# EasyEDA Pro project TC358870 HDMI2MIPI.epro, schematic new_1

## Sheets
1 Bridge
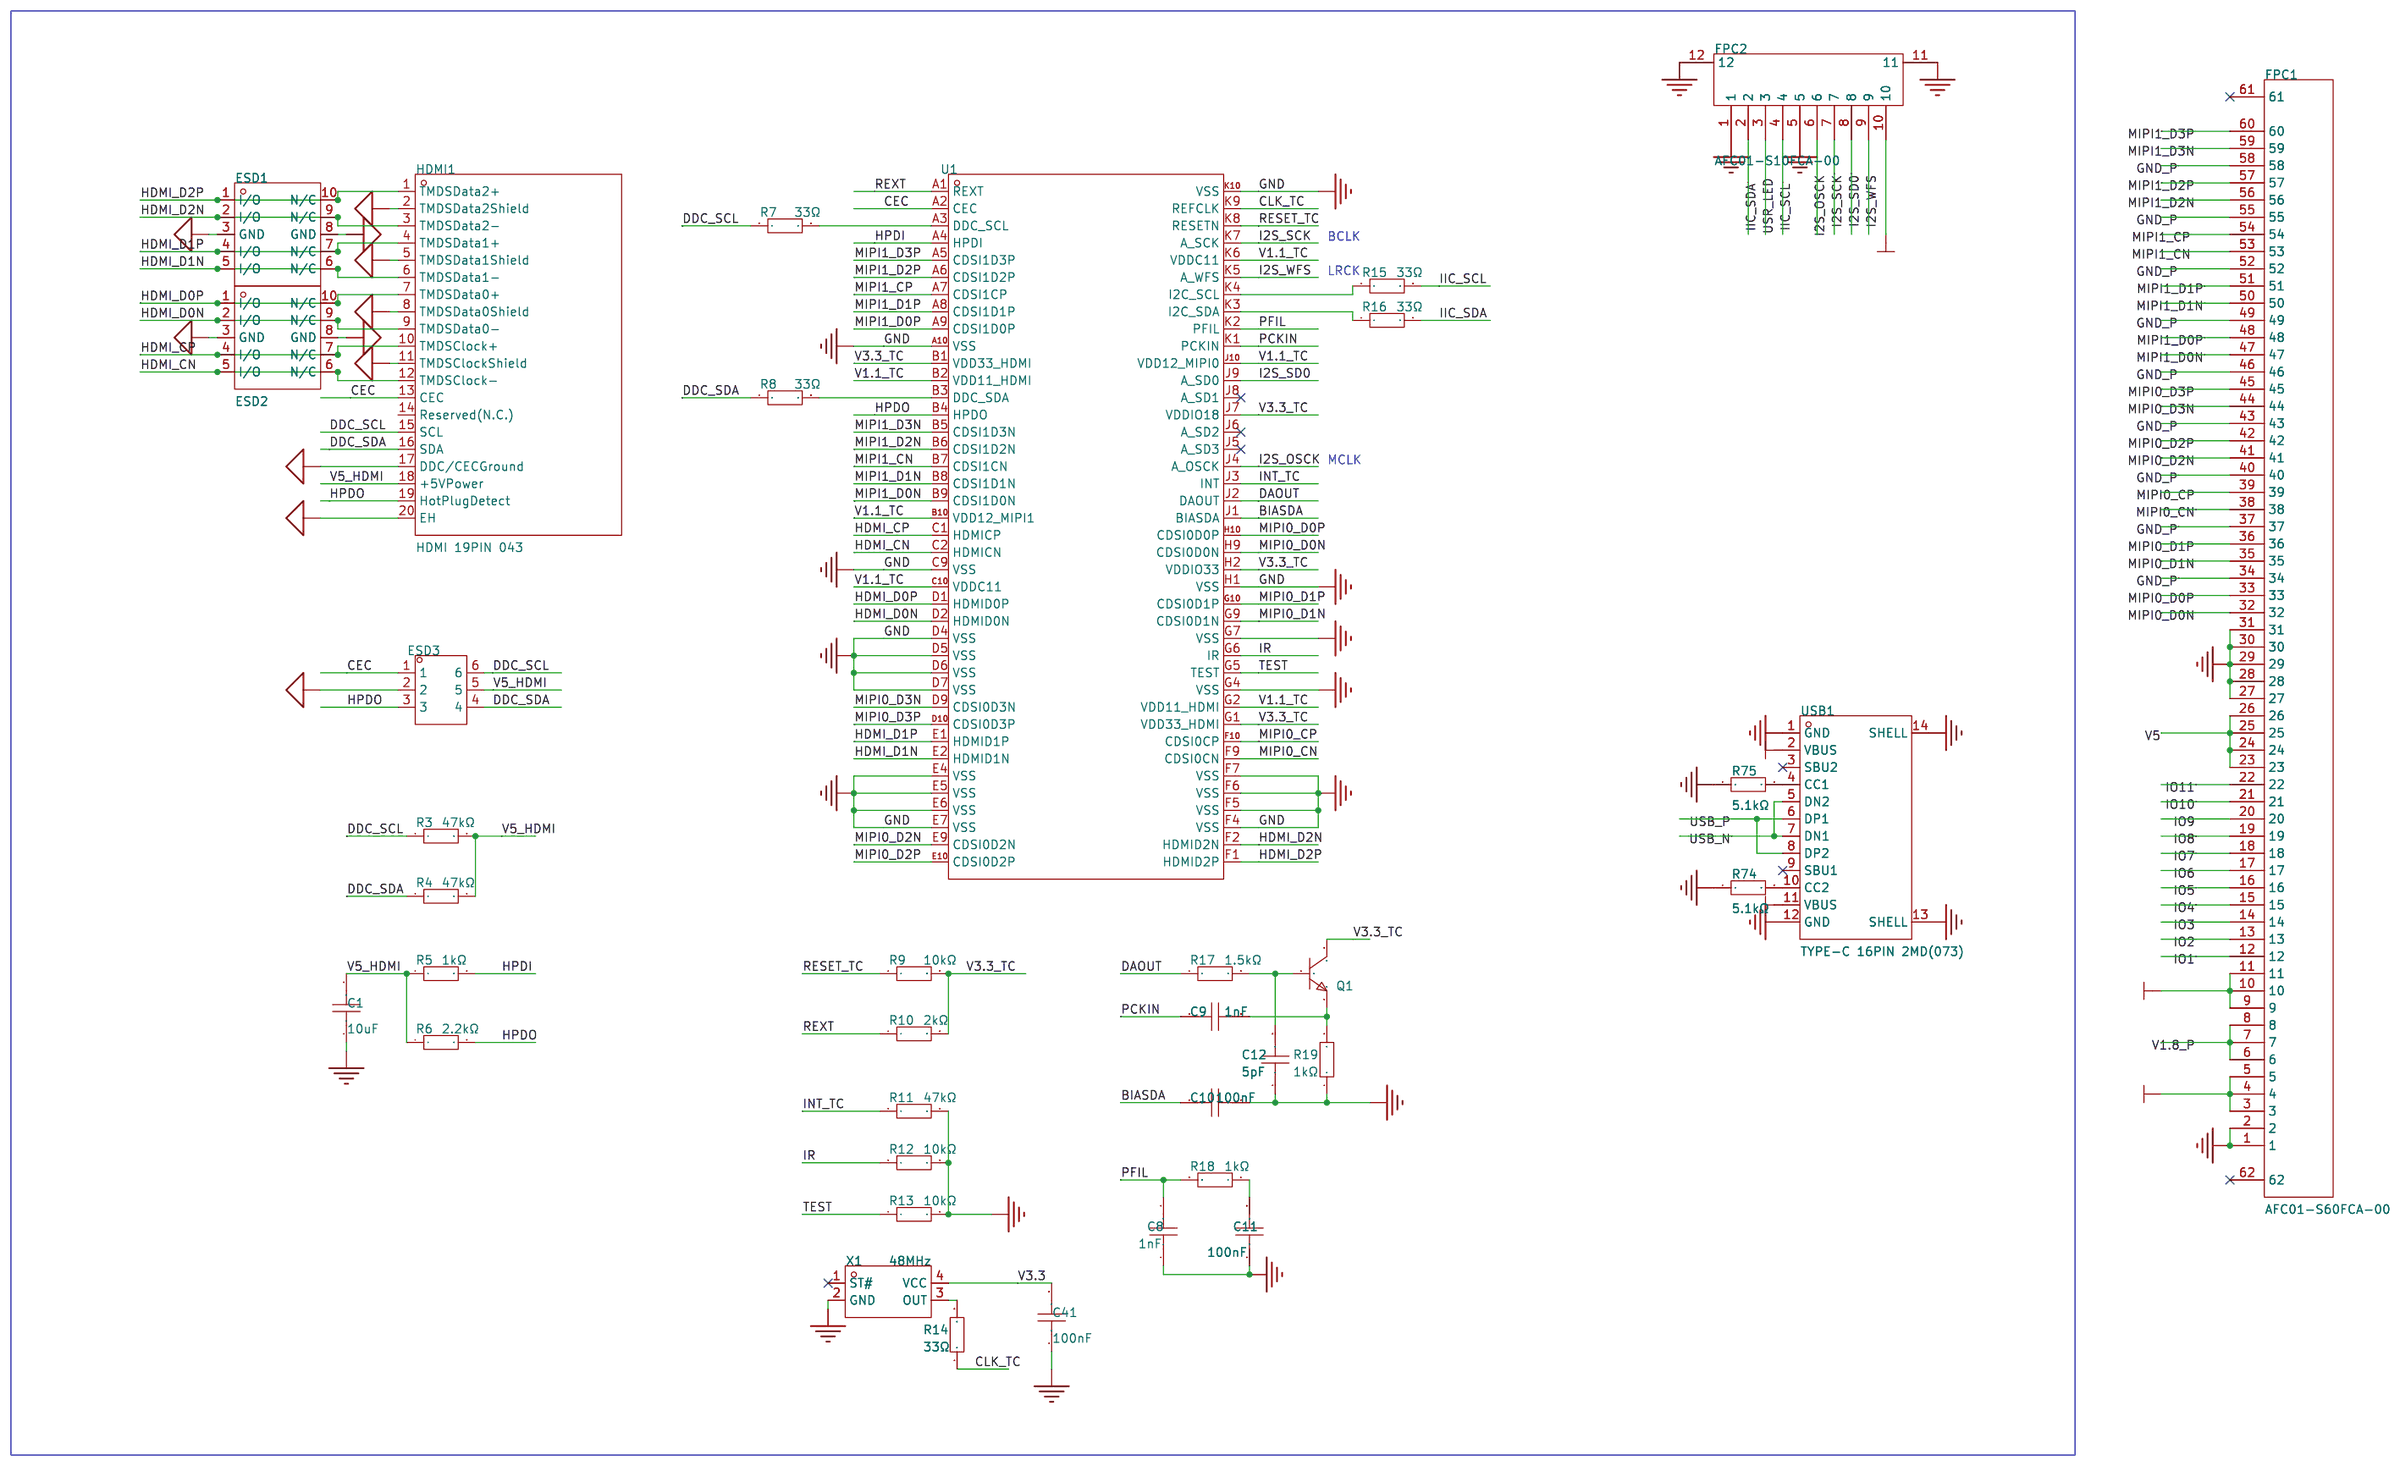
[diagram p2: Bridge]
2 MCU
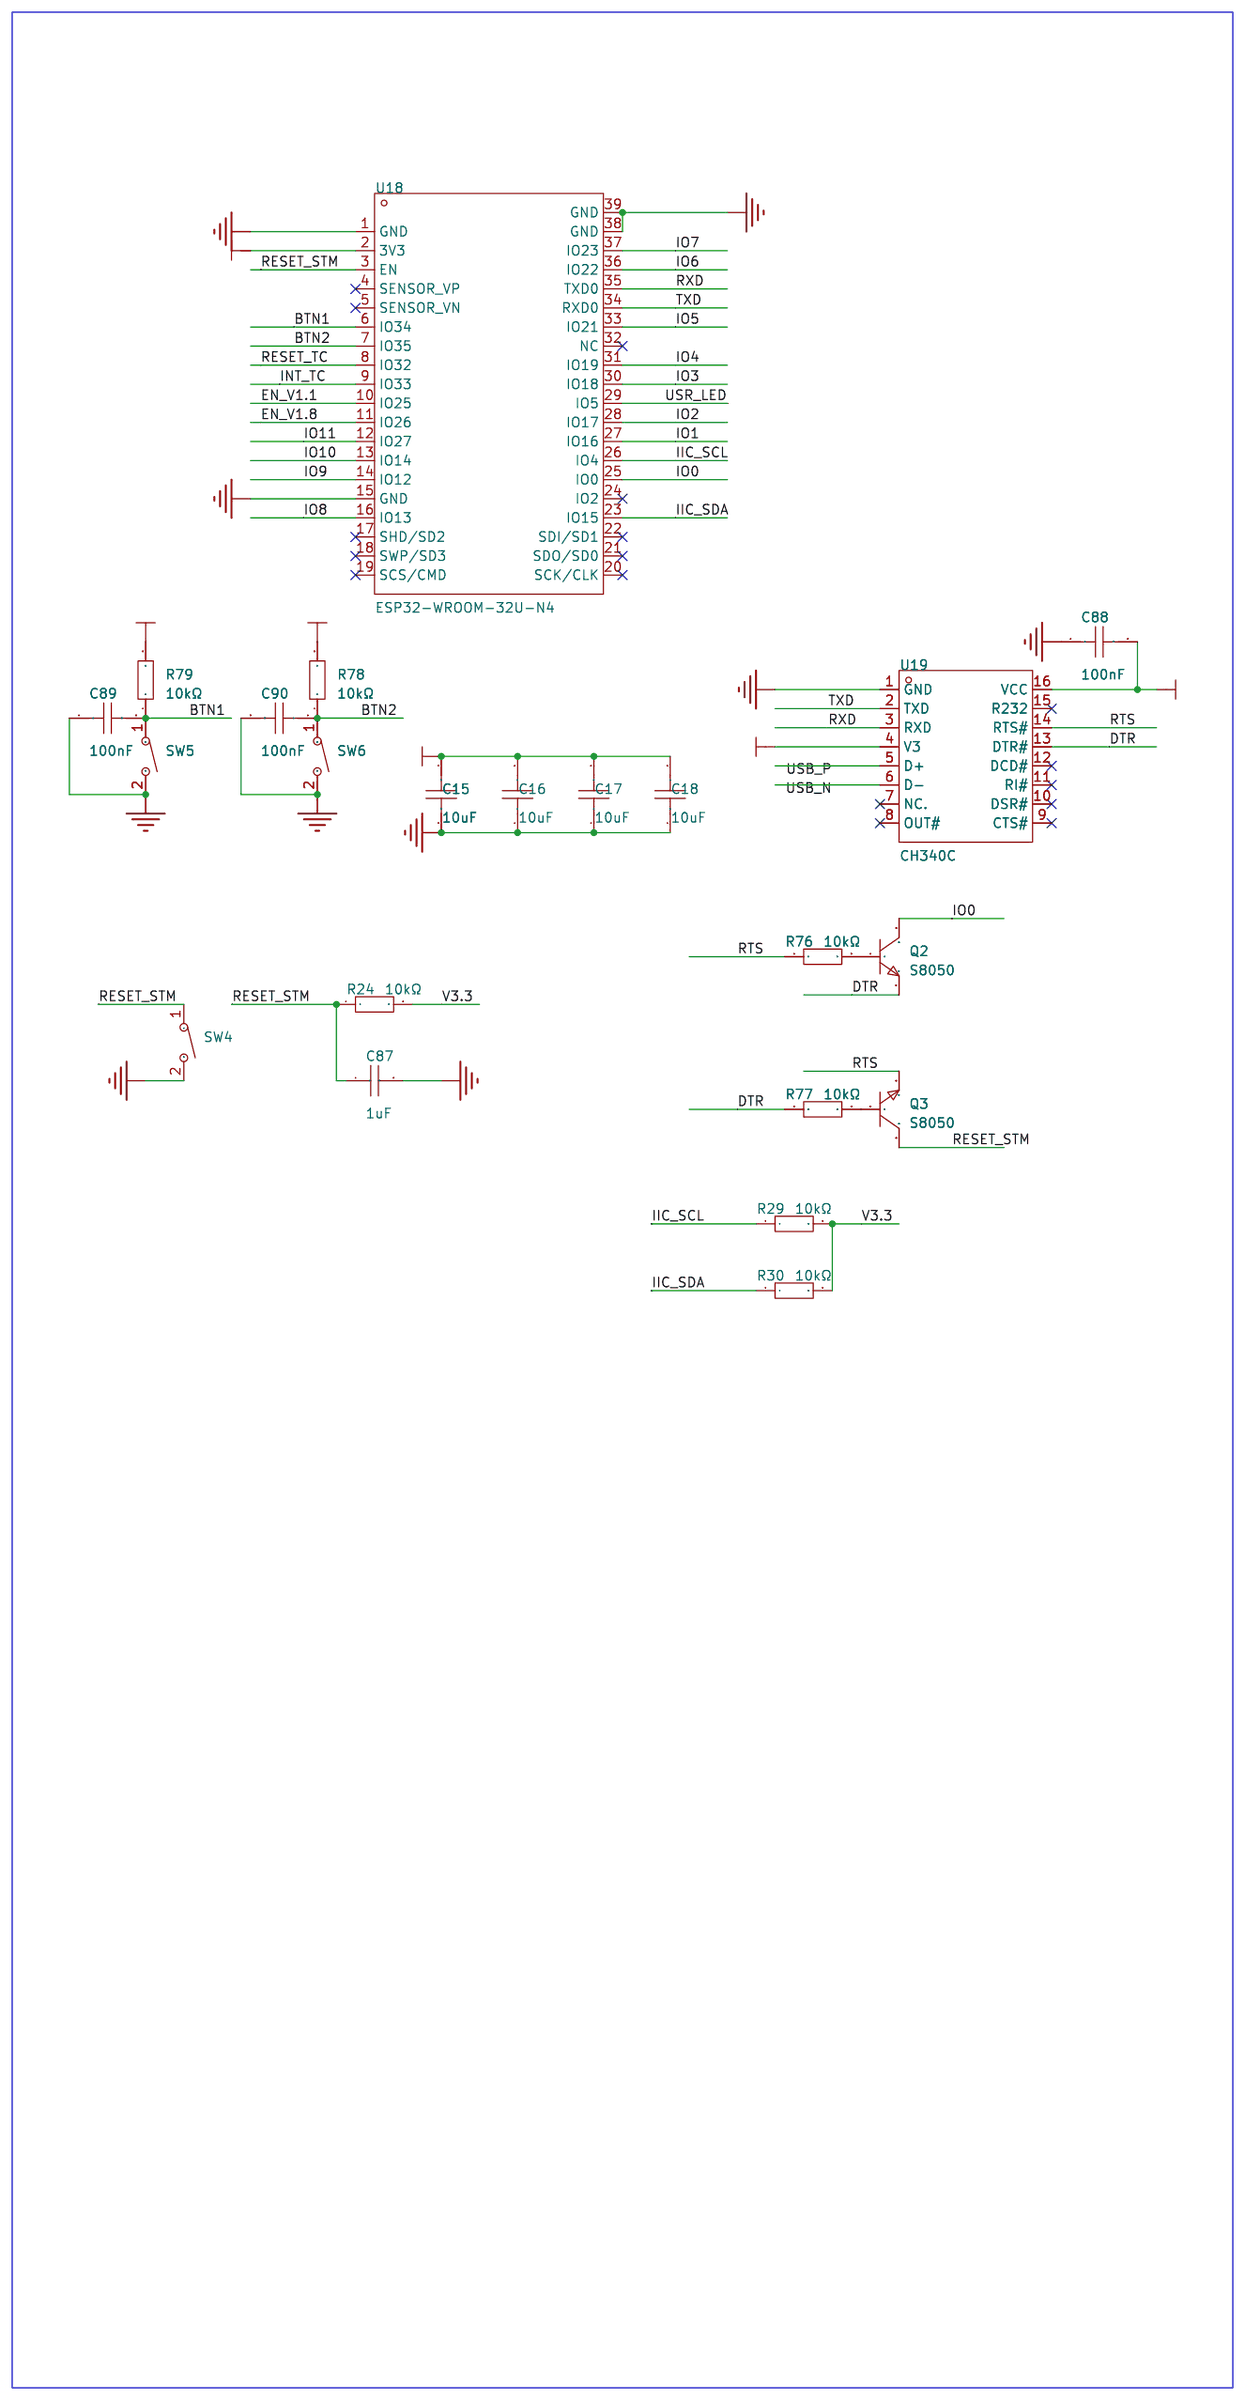
[diagram p3: MCU]
3 Power
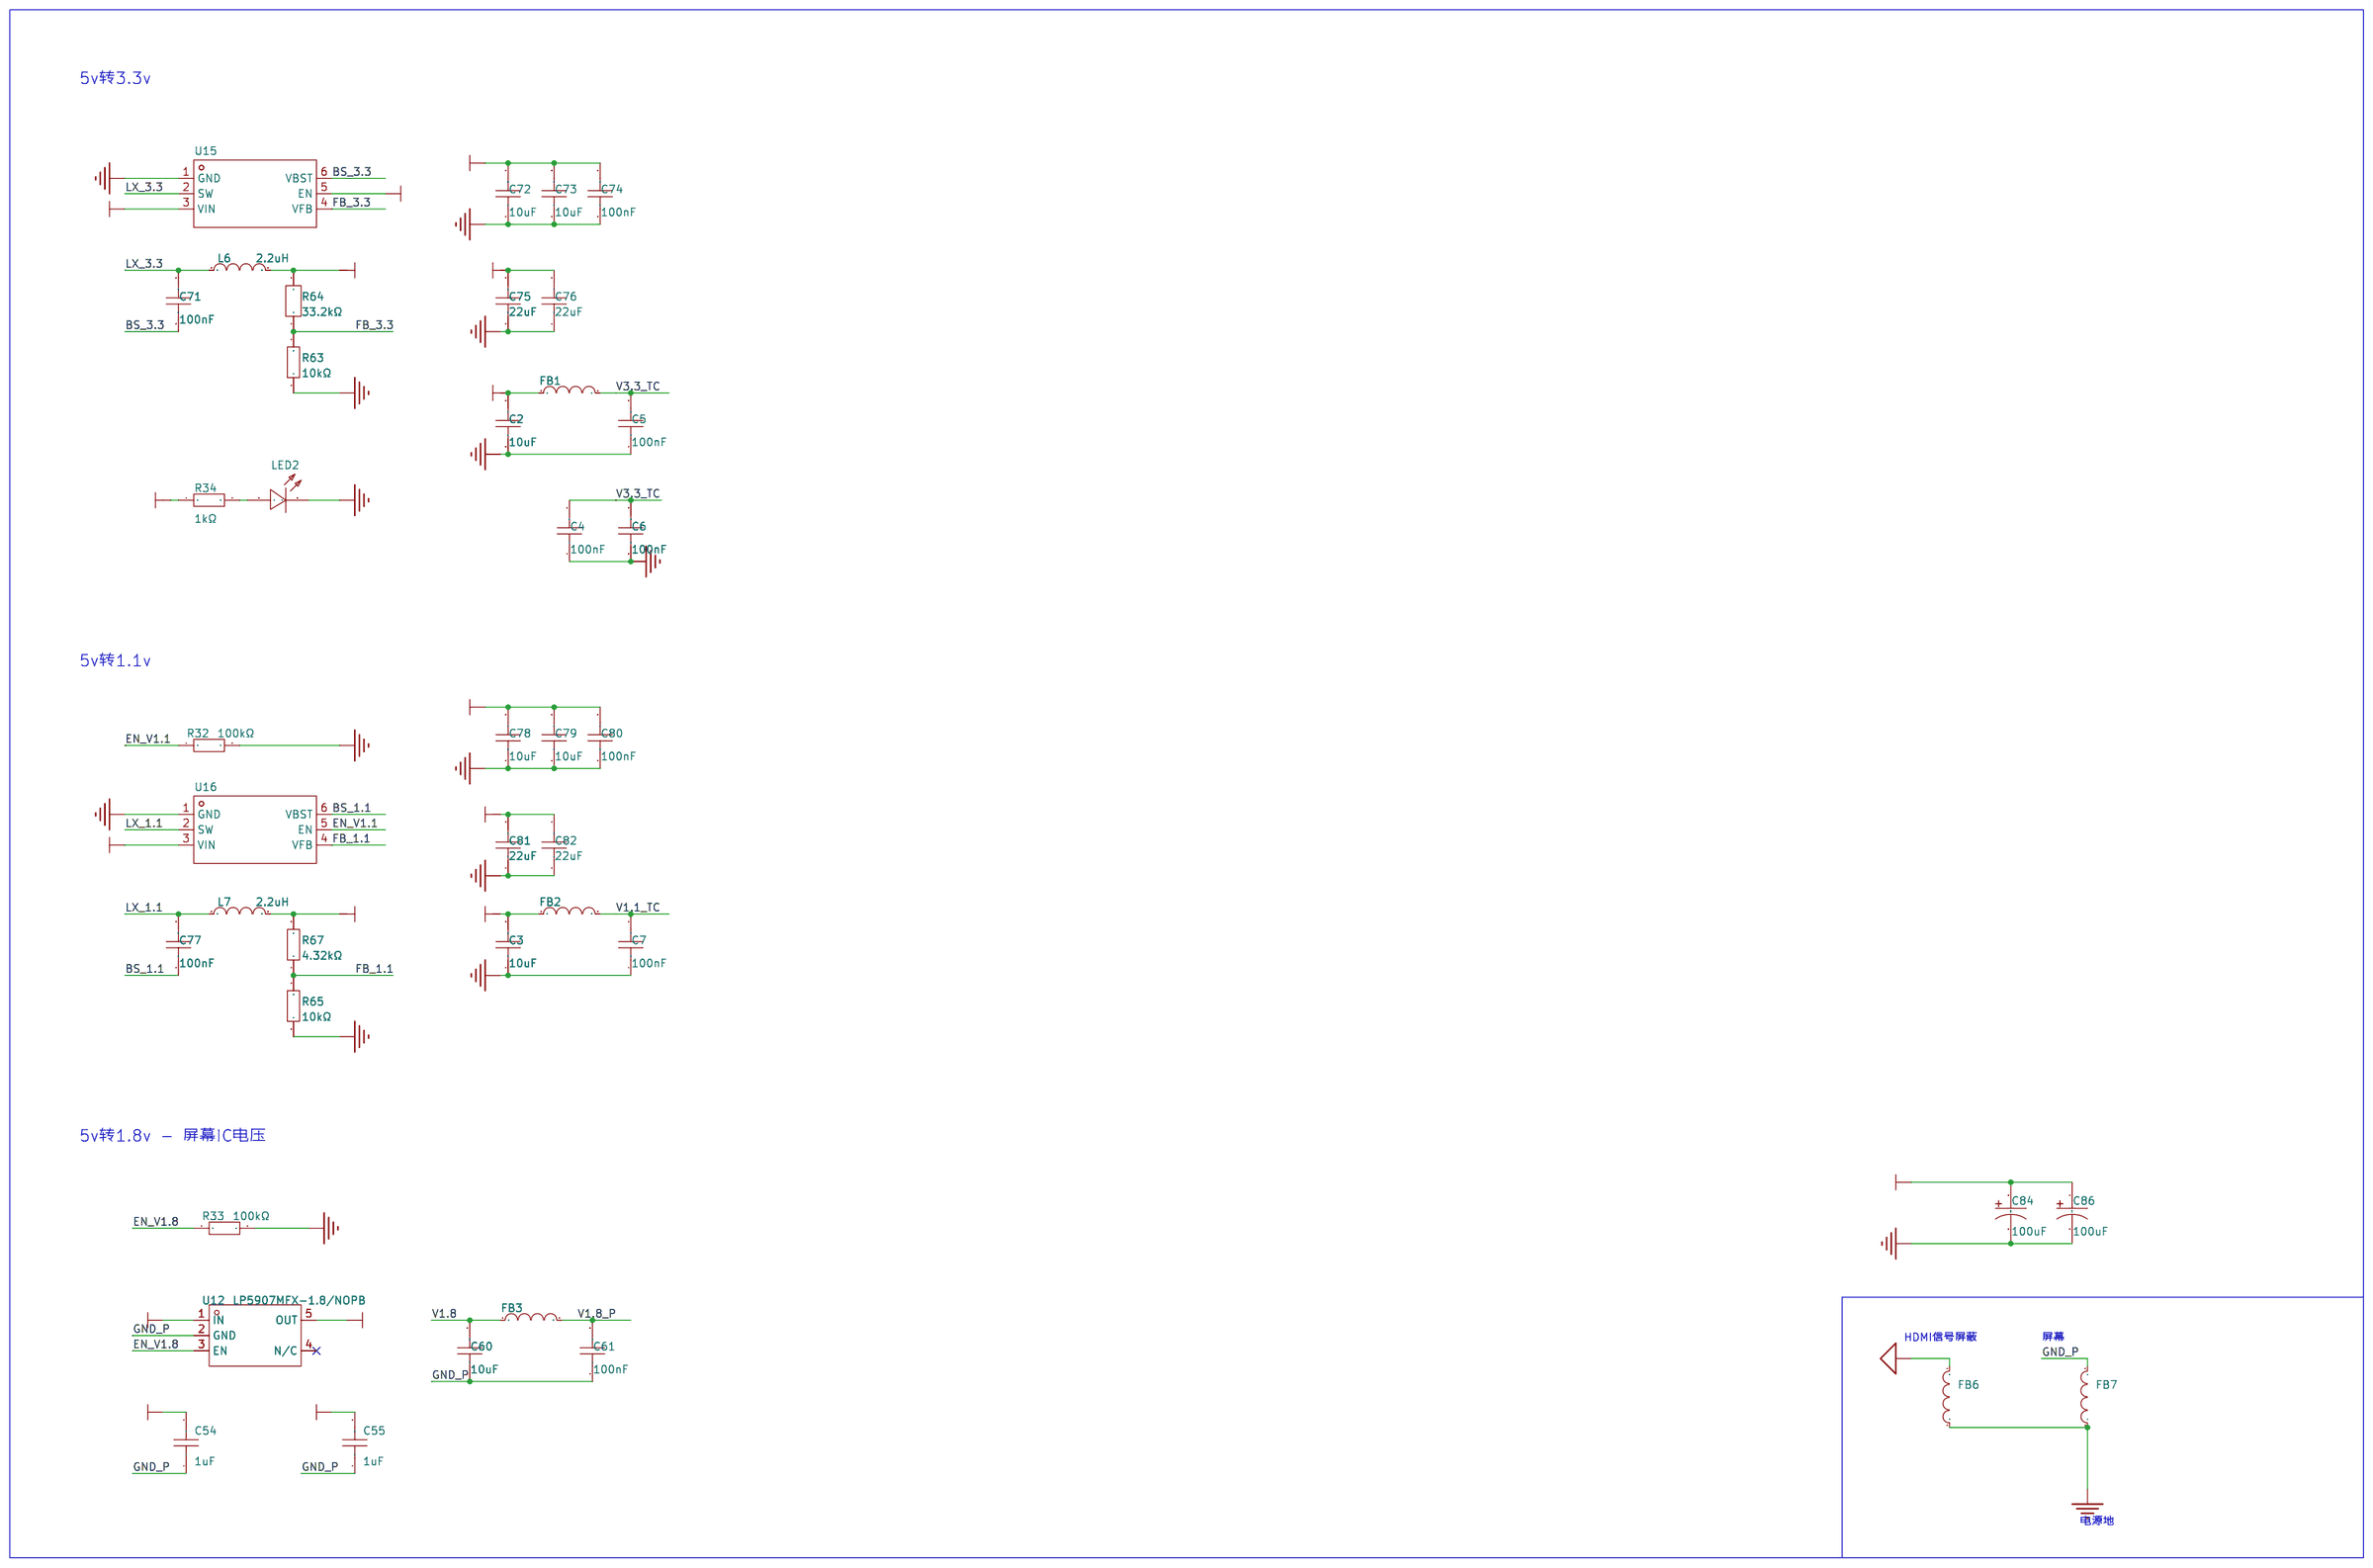
[diagram p4: Power]

## Parts
sheet Bridge
C1  10uF  [C0603]
C8  1nF  [C0603]
C9  1nF  [C0603]
C10  100nF  [C0603]
C11  100nF  [C0603]
C12  5pF  [C0603]
C41  100nF  [C0603]
ESD1  ESD7004MUTAG  [UDFN-10_L2.5-W1.0-P0.50-BL]
ESD2  ESD7004MUTAG  [UDFN-10_L2.5-W1.0-P0.50-BL]
ESD3  NUP4114HMR6T1G  [SOT-23-6_L2.9-W1.6-P0.95-LS2.8-BR]
FPC1  AFC01-S60FCA-00  [FPC-SMD_AFC01-S60FCC-00]
FPC2  AFC01-S10FCA-00  [FPC-SMD_P0.5-10P_FGS-XJ-H2.0]
HDMI1  HDMI 19PIN 043  [HDMI-SMD_HDMI-19PIN-043]
Q1  S8050  [SOT-23-3_L2.9-W1.6-P1.90-LS2.8-BR]
R3  47kΩ  [R0603]
R4  47kΩ  [R0603]
R5  1kΩ  [R0603]
R6  2.2kΩ  [R0603]
R7  33Ω  [R0603]
R8  33Ω  [R0603]
R9  10kΩ  [R0603]
R10  2kΩ  [R0603]
R11  47kΩ  [R0603]
R12  10kΩ  [R0603]
R13  10kΩ  [R0603]
R14  33Ω  [R0603]
R15  33Ω  [R0603]
R16  33Ω  [R0603]
R17  1.5kΩ  [R0603]
R18  1kΩ  [R0603]
R19  1kΩ  [R0603]
R74  5.1kΩ  [R0603]
R75  5.1kΩ  [R0603]
U1  TC358870XBG(NOK)  [P-VFBGA-80_L7.0-W7.0-R10-C10-P0.65-TL]
USB1  TYPE-C 16PIN 2MD(073)  [USB-C-SMD_TYPE-C-6PIN-2MD-073]
X1  48MHz  [OSC-SMD_4P-L3.2-W2.5-BL]
sheet MCU
C15  10uF  [C0603]
C16  10uF  [C0603]
C17  10uF  [C0603]
C18  10uF  [C0603]
C87  1uF  [C0603]
C88  100nF  [C0603]
C89  100nF  [C0603]
C90  100nF  [C0603]
Q2  S8050  [SOT-23-3_L2.9-W1.6-P1.90-LS2.8-BR]
Q3  S8050  [SOT-23-3_L2.9-W1.6-P1.90-LS2.8-BR]
R24  10kΩ  [R0603]
R29  10kΩ  [R0603]
R30  10kΩ  [R0603]
R76  10kΩ  [R0603]
R77  10kΩ  [R0603]
R78  10kΩ  [R0603]
R79  10kΩ  [R0603]
SW4  -  [SW-SMD_L4.0-W2.9-LS5.0]
SW5  -  [SW-SMD_L4.0-W2.9-LS5.0]
SW6  -  [SW-SMD_L4.0-W2.9-LS5.0]
U18  ESP32-WROOM-32U-N4  [WIFIM-SMD_38P-L19.2-W18.0-P1.27]
U19  CH340C  [SOP-16_L10.0-W3.9-P1.27-LS6.0-BL]
sheet Power
C2  10uF  [C0603]
C3  10uF  [C0603]
C4  100nF  [C0603]
C5  100nF  [C0603]
C6  100nF  [C0603]
C7  100nF  [C0603]
C54  1uF  [C0603]
C55  1uF  [C0603]
C60  10uF  [C0603]
C61  100nF  [C0603]
C71  100nF  [C0603]
C72  10uF  [C0603]
C73  10uF  [C0603]
C74  100nF  [C0603]
C75  22uF  [C0603]
C76  22uF  [C0603]
C77  100nF  [C0603]
C78  10uF  [C0603]
C79  10uF  [C0603]
C80  100nF  [C0603]
C81  22uF  [C0603]
C82  22uF  [C0603]
C84  100uF  [CAP-SMD_L3.5-W2.8-R-RD]
C86  100uF  [CAP-SMD_L3.5-W2.8-R-RD]
FB1  BLM18PG121SN1D  [L0603]
FB2  BLM18PG121SN1D  [L0603]
FB3  BLM18PG121SN1D  [L0603]
FB6  BLM18PG121SN1D  [L0603]
FB7  BLM18PG121SN1D  [L0603]
L6  2.2uH  [IND-SMD_L2.5-W2.0]
L7  2.2uH  [IND-SMD_L2.5-W2.0]
LED2  -  [LED0603-R-RD_WHITE]
R32  100kΩ  [R0603]
R33  100kΩ  [R0603]
R34  1kΩ  [R0603]
R63  10kΩ  [R0603]
R64  33.2kΩ  [R0603]
R65  10kΩ  [R0603]
R67  4.32kΩ  [R0603]
U12  LP5907MFX-1.8/NOPB  [SOT-23-5_L3.0-W1.7-P0.95-LS2.8-BR]
U15  TPS562208DDCR  [SOT-23-6_L2.9-W1.6-P0.95-LS2.8-BR]
U16  TPS562208DDCR  [SOT-23-6_L2.9-W1.6-P0.95-LS2.8-BR]

## Library data of the parts
C1-C3 C15-C18 C60 C72 C73 C78 C79 = CC0603MRX5R8BB106: 容值:10uF;精度:±20%;额定电压:25V;材质(温度系数):X5R;; LCSC Part Name: 10uF ±20% 25V; Supplier Part: C596327; Manufacturer: YAGEO(国巨); Supplier Footprint: 0603; JLCPCB Part Class: 扩展库; Datasheet: https://atta.szlcsc.com/upload/public/pdf/source/20200609/C596327_17DF31B1E9B32F0BAA34398C136F635E.pdf; Supplier: LCSC; Tolerance: ±20%; Voltage Rated: 25V; Temperature Coefficient: X5R
C8 C9 = CL10B102KB8NNNC: 容值:1nF;精度:±10%;额定电压:50V;材质(温度系数):X7R;; LCSC Part Name: 1nF ±10% 50V; Supplier Part: C1588; Manufacturer: SAMSUNG(三星); Supplier Footprint: 0603; JLCPCB Part Class: Basic Part; Datasheet: https://atta.szlcsc.com/upload/public/pdf/source/20160103/1457707679526.pdf; Supplier: LCSC; Tolerance: ±10%; Voltage Rated: 50V; Temperature Coefficient: X7R
C4-C7 C10 C11 C41 C61 C71 C74 C77 C80 C88-C90 = CC0603KRX7R9BB104: 容值:100nF;精度:±10%;额定电压:50V;材质(温度系数):X7R;; LCSC Part Name: 100nF ±10% 50V; Supplier Part: C14663; Manufacturer: YAGEO(国巨); Supplier Footprint: 0603; JLCPCB Part Class: 基础库; Datasheet: https://atta.szlcsc.com/upload/public/pdf/source/20170116/1484561234239.pdf; Supplier: LCSC; Tolerance: ±10%; Voltage Rated: 50V; Temperature Coefficient: X7R
C12 = CL10C050BB8NNNC: 容值:5pF;精度:±0.1pF;额定电压:50V;材质(温度系数):C0G;; LCSC Part Name: 5pF ±0.1pF 50V; Supplier Part: C307495; Manufacturer: SAMSUNG(三星); Supplier Footprint: 0603; JLCPCB Part Class: Extended Part; Datasheet: https://atta.szlcsc.com/upload/public/pdf/source/20181106/C307495_40E91552D1B784076ED9D3C3B46C5793.pdf; Supplier: LCSC; Tolerance: ±0.1pF; Voltage Rated: 50V; Temperature Coefficient: C0G
ESD1 ESD2 = ESD7004MUTAG: 反向截止电压(Vrwm):5V;击穿电压(VBR):5.5V;峰值脉冲电流(Ipp)@8/20us:1A@(8/20us);钳位电压(Vc)@Ipp:10V;峰值脉冲功率(Ppp)@8/20us:-;结电容(Cj)@1MHz:0.4pF@1MHz;工作温度:-55℃~+125℃@(Tj);; LCSC Part Name: ESD Protection Diode with Low Capacitance; Supplier Part: C1972960; Manufacturer: onsemi(安森美); Supplier Footprint: UDFN-10(1x2.5); JLCPCB Part Class: 扩展库; Datasheet: https://atta.szlcsc.com/upload/public/pdf/source/20201127/C294530_C0006EA10DA7174AECD43404D82BADC3.pdf; Supplier: LCSC; Reverse Stand-Off Voltage (Vrwm): 5V; Breakdown Voltage (VBR): 5.5V; Peak Pulse Current(Ipp)@8/20us: 1A@(8/20us); Clamping Voltage@Ipp: 10V; Junction Capacitance(Cj)@1MHz: 0.4pF@1MHz; Operating Temperature: -55℃~+125℃@(Tj)
ESD3 = NUP4114HMR6T1G: Supplier Part: C260431; Manufacturer: onsemi(安森美); Supplier Footprint: SOT-23-6; JLCPCB Part Class: 扩展库; Datasheet: https://atta.szlcsc.com/upload/public/pdf/source/20180801/C260431_50B6EE707D505754417F87B3D09AAF49.pdf; Supplier: LCSC
FPC1 = AFC01-S60FCA-00: 锁定特性:翻盖式;触点类型:下接;触点数量:60P;间距:0.5mm;安装类型:卧贴;; LCSC Part Name: 间距:0.5mm P数:60P 翻盖式 下接; Supplier Part: C262678; Manufacturer: JS(钜硕电子); Supplier Footprint: SMD,P=0.5mm,卧贴; JLCPCB Part Class: 扩展库; Datasheet: https://atta.szlcsc.com/upload/public/pdf/source/20190726/C11047_78689421E6D6672DE8D11ECCF89B3729.pdf; Supplier: LCSC; Locking Feature: 翻盖式; Contact Type: 下接; Number of Contacts: 60P; Pitch: 0.5mm; Mounting Type: 卧贴; FFC, FCB Thickness: 0.3mm; Height Above Board: 2mm
FPC2 = AFC01-S10FCA-00: 锁定特性:翻盖式;触点类型:下接;触点数量:10P;间距:0.5mm;安装类型:卧贴;; LCSC Part Name: 间距:0.5mm P数:10P 翻盖式 下接; Supplier Part: C262659; Manufacturer: JS(钜硕电子); Supplier Footprint: SMD,P=0.5mm,卧贴; JLCPCB Part Class: 扩展库; Datasheet: https://atta.szlcsc.com/upload/public/pdf/source/20190816/C413942_2A72D1AC756EAE17EEDF756A339D4500.pdf; Supplier: LCSC; Locking Feature: 翻盖式; Contact Type: 下接; Number of Contacts: 10P; Pitch: 0.5mm; Mounting Type: 卧贴; FFC, FCB Thickness: 0.3mm; Height Above Board: 2mm
HDMI1 = HDMI 19PIN 043: 连接器类型:HDMI;公母:母;总PIN位数:19P;安装方式:卧贴;排数:-;额定电流:300mA;工作温度范围:-55℃~+85℃;; LCSC Part Name: HDMI 母 P数:19P; Supplier Part: C2858275; Manufacturer: SHOU HAN(首韩); Supplier Footprint: SMD; JLCPCB Part Class: 扩展库; Datasheet: https://atta.szlcsc.com/upload/public/pdf/source/20210728/C2858275_DF299413048A9CF092C2A61AB97004F4.pdf; Supplier: LCSC; Connector Type: HDMI; Gender: 母; Number of Pins: 19P; Mounting Style: 卧贴; Current Rating (Max): 300mA; Operating Temperature Range: -55℃~+85℃
Q1-Q3 = S8050_C181158: 晶体管类型:NPN;集电极电流(Ic):500mA;集射极击穿电压(Vceo):25V;功率(Pd):300mW;; LCSC Part Name: NPN 电流:500mA 耐压:25V; Supplier Part: C181158; Manufacturer: Hottech(合科泰); Supplier Footprint: SOT-23; JLCPCB Part Class: Extended Part; Datasheet: https://atta.szlcsc.com/upload/public/pdf/source/20220506/D987F39D56F2975D34EC7947E75C4ABC.pdf; Supplier: LCSC; Transistor Type: NPN; Collector Current (Ic): 500mA; Collector-Emitter Breakdown Voltage (Vceo): 25V; Power Dissipation (Pd): 300mW; Transition Frequency (fT): 150MHz; Collector Cut-Off Current (Icbo): 100nA; Collector-Emitter Saturation Voltage (VCE(sat)@Ic,Ib): 600mV@500mA,50mA
R3 R4 = CR0603FA4702G: 电阻类型:厚膜电阻;阻值:47kΩ;精度:±1%;功率:100mW;温度系数:±100ppm/℃;最大工作电压:50V;工作温度范围:-55℃~+125℃;; LCSC Part Name: 47kΩ ±1% 100mW; Supplier Part: C101063; Manufacturer: LIZ(丽智电子); Supplier Footprint: 0603; JLCPCB Part Class: 扩展库; Datasheet: https://atta.szlcsc.com/upload/public/pdf/source/20170408/1491631381276.pdf; Supplier: LCSC; Type: 厚膜电阻; Tolerance: ±1%; Power(Watts): 100mW; Temperature Coefficient: ±100ppm/℃; Overload Voltage (Max): 50V; Operating Temperature Range: -55℃~+125℃
R5 R34 = 0603WAF1001T5E: 电阻类型:厚膜电阻;阻值:1kΩ;精度:±1%;功率:100mW;温度系数:±100ppm/℃;最大工作电压:75V;工作温度范围:-55℃~+155℃;; LCSC Part Name: 1kΩ ±1% 100mW; Supplier Part: C21190; Manufacturer: UNI-ROYAL(厚声); Supplier Footprint: 0603; JLCPCB Part Class: 基础库; Datasheet: https://atta.szlcsc.com/upload/public/pdf/source/20200306/C422600_1E6D84923E4A46A82E41ADD87F860B5C.pdf; Supplier: LCSC; Type: 厚膜电阻; Tolerance: ±1%; Power(Watts): 100mW; Temperature Coefficient: ±100ppm/℃; Overload Voltage (Max): 75V; Operating Temperature Range: -55℃~+155℃
R6 = 0603WAF2201T5E: 电阻类型:厚膜电阻;阻值:2.2kΩ;精度:±1%;功率:100mW;温度系数:±100ppm/℃;最大工作电压:75V;工作温度范围:-55℃~+155℃;; LCSC Part Name: 2.2kΩ ±1% 100mW; Supplier Part: C4190; Manufacturer: UNI-ROYAL(厚声); Supplier Footprint: 0603; JLCPCB Part Class: 基础库; Datasheet: https://atta.szlcsc.com/upload/public/pdf/source/20200306/C422600_1E6D84923E4A46A82E41ADD87F860B5C.pdf; Supplier: LCSC; Type: 厚膜电阻; Tolerance: ±1%; Power(Watts): 100mW; Temperature Coefficient: ±100ppm/℃; Overload Voltage (Max): 75V; Operating Temperature Range: -55℃~+155℃
R7 R8 R14-R16 = ETCR0603F33R0K9: 阻值:33Ω;精度:±1%;功率:100mW;; LCSC Part Name: 33Ω ±1% 100mW; Supplier Part: C365420; Manufacturer: RESI(开步睿思）; Supplier Footprint: 0603; JLCPCB Part Class: 扩展库; Datasheet: https://atta.szlcsc.com/upload/public/pdf/source/20190121/C365420_EFFD78D556BE40A703F3F41F0D3ECDA1.pdf; Supplier: LCSC; Tolerance: ±1%; Power(Watts): 100mW
R9 R12 R13 R24 R29 R30 R63 R65 R76-R79 = 0603WAF1002T5E: 电阻类型:厚膜电阻;阻值:10kΩ;精度:±1%;功率:100mW;温度系数:±100ppm/℃;最大工作电压:75V;工作温度范围:-55℃~+155℃;; LCSC Part Name: 10kΩ ±1% 100mW; Supplier Part: C25804; Manufacturer: UNI-ROYAL(厚声); Supplier Footprint: 0603; JLCPCB Part Class: 基础库; Datasheet: https://atta.szlcsc.com/upload/public/pdf/source/20200306/C422600_1E6D84923E4A46A82E41ADD87F860B5C.pdf; Supplier: LCSC; Type: 厚膜电阻; Tolerance: ±1%; Power(Watts): 100mW; Temperature Coefficient: ±100ppm/℃; Overload Voltage (Max): 75V; Operating Temperature Range: -55℃~+155℃
R10 = 0603WAF2001T5E: 精度:±1%;阻值:2kΩ;温度系数:±100ppm/℃;功率:1/10W;最大工作电压:75V;工作温度范围:-55℃~+155℃;; LCSC Part Name: 2KΩ ±1%; Supplier Part: C22975; Manufacturer: UNI-ROYAL(厚声); Supplier Footprint: 0603; JLCPCB Part Class: 基础库; Datasheet: https://atta.szlcsc.com/upload/public/pdf/source/20170920/C22975_1505901012894982362.pdf; Supplier: LCSC; Tolerance: ±1%; Temperature Coefficient: ±100ppm/℃; Power(Watts): 1/10W; Overload Voltage (Max): 75V; Operating Temperature Range: -55℃~+155℃
R11 = 0603WAF4702T5E: 精度:±1%;温度系数:±100ppm/℃;功率:1/10W;阻值:47kΩ;最大工作电压:75V;工作温度范围:-55℃~+155℃;; LCSC Part Name: 47KΩ ±1%; Supplier Part: C25819; Manufacturer: UNI-ROYAL(厚声); Supplier Footprint: 0603; JLCPCB Part Class: Basic Part; Datasheet: https://atta.szlcsc.com/upload/public/pdf/source/20170920/C25819_1505901557326983389.pdf; Supplier: LCSC; Tolerance: ±1%; Temperature Coefficient: ±100ppm/℃; Power(Watts): 1/10W; Overload Voltage (Max): 75V; Operating Temperature Range: -55℃~+155℃; Type: 厚膜电阻
R17 = 0603WAF1501T5E: 阻值:1.5kΩ;精度:±1%;温度系数:±100ppm/℃;功率:1/10W;最大工作电压:75V;工作温度范围:-55℃~+155℃;; LCSC Part Name: 1.5KΩ ±1%; Supplier Part: C22843; Manufacturer: UNI-ROYAL(厚声); Supplier Footprint: 0603; JLCPCB Part Class: Basic Part; Datasheet: https://atta.szlcsc.com/upload/public/pdf/source/20170920/C22843_1505887489783980640.pdf; Supplier: LCSC; Tolerance: ±1%; Temperature Coefficient: ±100ppm/℃; Power(Watts): 1/10W; Overload Voltage (Max): 75V; Operating Temperature Range: -55℃~+155℃
R18 R19 = 0603WAF1001T5E: 电阻类型:厚膜电阻;阻值:1kΩ;精度:±1%;功率:100mW;温度系数:±100ppm/℃;最大工作电压:75V;工作温度范围:-55℃~+155℃;; LCSC Part Name: 1kΩ ±1% 100mW; Supplier Part: C21190; Manufacturer: UNI-ROYAL(厚声); Supplier Footprint: 0603; JLCPCB Part Class: Basic Part; Datasheet: https://atta.szlcsc.com/upload/public/pdf/source/20200306/C422600_1E6D84923E4A46A82E41ADD87F860B5C.pdf; Supplier: LCSC; Type: 厚膜电阻; Tolerance: ±1%; Power(Watts): 100mW; Temperature Coefficient: ±100ppm/℃; Overload Voltage (Max): 75V; Operating Temperature Range: -55℃~+155℃
R74 R75 = 0603WAF5101T5E: 电阻类型:厚膜电阻;阻值:5.1kΩ;精度:±1%;功率:100mW;最大工作电压:75V;温度系数:±100ppm/℃;; LCSC Part Name: 5.1kΩ ±1% 100mW 厚膜电阻; Supplier Part: C23186; Manufacturer: UNI-ROYAL(厚声); Supplier Footprint: 0603; JLCPCB Part Class: 基础库; Datasheet: https://atta.szlcsc.com/upload/public/pdf/source/20200306/C422600_1E6D84923E4A46A82E41ADD87F860B5C.pdf; Supplier: LCSC; Type: 厚膜电阻; Tolerance: ±1%; Power(Watts): 100mW; Overload Voltage (Max): 75V; Temperature Coefficient: ±100ppm/℃; Operating Temperature Range: -55℃~+155℃
U1 = TC358870XBG(NOK): LCSC Part Name: TC358870XBG(NOK) 无HDCP; Supplier Part: C3008712; Manufacturer: TOSHIBA(东芝); JLCPCB Part Class: 扩展库; Datasheet: https://atta.szlcsc.com/upload/public/pdf/source/20211016/C2887171_F9292D77A06E9D3535D55A918640DB23.pdf; Supplier: LCSC
USB1 = TYPE-C 16PIN 2MD(073): 连接器类型:Type-C;标准:-;公母:母;端口数量:1;触点数量:16P;安装方式:卧贴;额定电流 - 电源:5A;工作温度范围:-25℃~+85℃;; LCSC Part Name: Type-C 母 卧贴; Supplier Part: C2765186; Manufacturer: SHOU HAN(首韩); Supplier Footprint: SMD; JLCPCB Part Class: 扩展库; Datasheet: https://atta.szlcsc.com/upload/public/pdf/source/20211123/39B17C16241EAC15C5E277BDA434118E.pdf; Supplier: LCSC; Connector Type: Type-C; Gender: 母; Number of Ports: 1; Number of Contacts: 16P; Mounting Style: 卧贴; Current Rating - Power (Max): 5A; Operating Temperature Range: -25℃~+85℃
X1 = Q33310F70050300: 频率:48MHz;工作电压:3.3V;供电电流:4.5mA;工作温度:-40℃~+85℃;; LCSC Part Name: 48MHz 3.3V 停产; Supplier Part: C32533; Manufacturer: EPSON(爱普生); Supplier Footprint: SMD3225-4P; JLCPCB Part Class: 扩展库; Datasheet: https://atta.szlcsc.com/upload/public/pdf/source/20161110/1478747428327.pdf; Supplier: LCSC; Supply Voltage: 3.3V; Supply Current (Max): 4.5mA; Operating Temperature: -40℃~+85℃
C54 C55 C87 = CL10A105KB8NNNC: 容值:1uF;精度:±10%;额定电压:50V;材质(温度系数):X5R;; LCSC Part Name: 1uF ±10% 50V; Supplier Part: C15849; Manufacturer: SAMSUNG(三星); Supplier Footprint: 0603; JLCPCB Part Class: Basic Part; Datasheet: https://atta.szlcsc.com/upload/public/pdf/source/20160103/1457707679084.pdf; Supplier: LCSC; Tolerance: ±10%; Voltage Rated: 50V; Temperature Coefficient: X5R
SW4-SW6 = TS342A2P-WZ: LCSC Part Name: 轻触开关 3*4*2 两脚小龟不带柱 250gf 黑色塑胶按钮; Supplier Part: C557591; Manufacturer: SHOU HAN(首韩); Supplier Footprint: SMD; JLCPCB Part Class: Extended Part; Datasheet: https://atta.szlcsc.com/upload/public/pdf/source/20200519/C557591_B3A5A21584733303F06306F18577DA8B.pdf; Supplier: LCSC
U18 = ESP32-WROOM-32U-N4_C328062: 通用型Wi-Fi+BT+BLE MCU模组; LCSC Part Name: 通用型Wi-Fi+BT+BLE MCU模组; Supplier Part: C328062; Manufacturer: ESPRESSIF(乐鑫); Supplier Footprint: SMD,18x19.2mm; JLCPCB Part Class: Extended Part; Datasheet: https://atta.szlcsc.com/upload/public/pdf/source/20241030/FABBD8327B67EE0A7C31EF04AF2F47D2.pdf; Supplier: LCSC
U19 = CH340C: 应用功能:收发器;接口协议:USB 2.0;数据速率:2Mbps;; LCSC Part Name: CH340C USB转串口芯片 CH340; Supplier Part: C84681; Manufacturer: WCH(南京沁恒); Supplier Footprint: SOP-16; JLCPCB Part Class: 扩展库; Datasheet: https://atta.szlcsc.com/upload/public/pdf/source/20200819/C84681_ADBED554CE321879DBD6B1D06488689C.pdf; Supplier: LCSC; Applications Function: 收发器; Protocol: USB 2.0; Supply Voltage: 3.3V；5V; Data Rate: 2Mbps
C75 C76 C81 C82 = CL10A226MP8NUNE: 容值:22uF;精度:±20%;额定电压:10V;材质(温度系数):X5R;; LCSC Part Name: 22uF ±20% 10V; Supplier Part: C86295; Manufacturer: SAMSUNG(三星); Supplier Footprint: 0603; JLCPCB Part Class: 扩展库; Datasheet: https://atta.szlcsc.com/upload/public/pdf/source/20170325/1490427882169.pdf; Supplier: LCSC; Tolerance: ±20%; Voltage Rated: 10V; Temperature Coefficient: X5R
C84 C86 = CA45A-B-10V-100UF-K: 容值:100uF;精度:±10%;额定电压:10V;; LCSC Part Name: 100uF ±10% 10V; Supplier Part: C2976906; Manufacturer: CEC(振华新云); Supplier Footprint: SMD,2.8x3.5mm; JLCPCB Part Class: Extended Part; Datasheet: https://atta.szlcsc.com/upload/public/pdf/source/20220222/C2C5F368BEBB90E653B4407F98E5644A.pdf; Supplier: LCSC; Tolerance: ±10%; Rated Voltage: 10V; Operating Temperature: -55℃~+125℃
FB1-FB3 FB6 FB7 = BLM18PG121SN1D: 标称阻抗@测试频率:120Ω@100MHz;误差:±25%;直流电阻(RDC):50mΩ;额定电流:2A;电路数:1;; LCSC Part Name: 120Ω@100MHz ±25%; Supplier Part: C14709; Manufacturer: muRata(村田); Supplier Footprint: SMD; JLCPCB Part Class: 扩展库; Datasheet: https://atta.szlcsc.com/upload/public/pdf/source/20130704/1457706621134.pdf; Supplier: LCSC; Impedance @ Frequency: 120Ω@100MHz; Tolerance: ±25%; DC Resistance: 50mΩ; Current Rating: 2A; Circuits: 1
L6 L7 = APH252010T2R2M: 类型:一体成型电感;电感值:2.2uH;精度:±20%;额定电流:2.1A;饱和电流(Isat):3A;; LCSC Part Name: 2.2uH ±20% 3A L252010-2R2M; Supplier Part: C5349606; Manufacturer: APV(爱普微); Supplier Footprint: L252010; JLCPCB Part Class: Extended Part; Datasheet: https://atta.szlcsc.com/upload/public/pdf/source/20230112/CD71A991BF44148C80048C09E1A9BC6B.pdf; Supplier: LCSC; Type: 一体成型电感; Tolerance: ±20%; Rated Current: 2.1A; Saturation Current (Isat): 3A; DC Resistance (DCR): 70mΩ
LED2 = TJ-S1608SW6TGLCCW-A5: 照明颜色:白色;主波长/色坐标:-;; LCSC Part Name: TJ-S1608SW6TGLCCW-A5 白色; Supplier Part: C192669; Manufacturer: TOGIALED(台湾统佳); Supplier Footprint: 0603; JLCPCB Part Class: Extended Part; Datasheet: https://atta.szlcsc.com/upload/public/pdf/source/20180604/C192669_B0D472CB769BD043C4F2A33F1E72AA62.pdf; Supplier: LCSC; Mounting Type: 表面贴装; Illumination Color: 白色; Luminous Intensity (IF=20mA): 700mcd
R32 R33 = 0603WAF1003T5E: 电阻类型:厚膜电阻;阻值:100kΩ;精度:±1%;功率:100mW;温度系数:±100ppm/℃;最大工作电压:75V;工作温度范围:-55℃~+155℃;; LCSC Part Name: 100kΩ ±1% 100mW; Supplier Part: C25803; Manufacturer: UNI-ROYAL(厚声); Supplier Footprint: 0603; JLCPCB Part Class: 基础库; Datasheet: https://atta.szlcsc.com/upload/public/pdf/source/20200306/C422600_1E6D84923E4A46A82E41ADD87F860B5C.pdf; Supplier: LCSC; Type: 厚膜电阻; Tolerance: ±1%; Power(Watts): 100mW; Temperature Coefficient: ±100ppm/℃; Overload Voltage (Max): 75V; Operating Temperature Range: -55℃~+155℃
R64 = ERJ3RBD3322V: 阻值:33.2kΩ;精度:±0.5%;功率:100mW;; LCSC Part Name: 33.2kΩ ±0.5% 100mW; Supplier Part: C416702; Manufacturer: PANASONIC(松下); Supplier Footprint: 0603; JLCPCB Part Class: Extended Part; Datasheet: https://atta.szlcsc.com/upload/public/pdf/source/20190902/C416702_C39013434E39DC6DD7078CC60C16DD21.pdf; Supplier: LCSC; Tolerance: ±0.5%; Power(Watts): 100mW; Temperature Coefficient: ±50ppm/℃; Overload Voltage (Max): 100V; Operating Temperature Range: -55℃~+155℃
R67 = 0603WAF4321T5E: 电阻类型:厚膜电阻;阻值:4.32kΩ;精度:±1%;功率:100mW;; LCSC Part Name: 4.32kΩ ±1% 100mW; Supplier Part: C23158; Manufacturer: UNI-ROYAL(厚声); Supplier Footprint: 0603; JLCPCB Part Class: Extended Part; Datasheet: https://atta.szlcsc.com/upload/public/pdf/source/20200306/C422600_1E6D84923E4A46A82E41ADD87F860B5C.pdf; Supplier: LCSC; Type: 厚膜电阻; Tolerance: ±1%; Power(Watts): 100mW; Temperature Coefficient: ±100ppm/℃; Overload Voltage (Max): 75V; Operating Temperature Range: -55℃~+155℃
U12 = LP5907MFX-1.8/NOPB: 输出类型:固定;输出极性:正;最大输入电压:5.5V;输出电压:1.8V~1.8V;输出电流:250mA;电源纹波抑制比(PSRR):90dB;; LCSC Part Name: 输入5.5V 输出1.8V~1.8V 250mA; Supplier Part: C92498; Manufacturer: TI(德州仪器); Supplier Footprint: SOT-23-5; JLCPCB Part Class: Extended Part; Datasheet: https://atta.szlcsc.com/upload/public/pdf/source/20230221/5933F7A77801C34991E6DC8A51DC8D54.pdf; Supplier: LCSC; Output Type: 固定; Output Polarity: 正; Number of Outputs: 1; Maximum Input Voltage: 5.5V; Output Voltage: 1.8V~1.8V; Dropout Voltage: 250mV@(250mA); Output Current: 250mA; Power Supply Rejection Ratio (PSRR): 90dB
U15 U16 = TPS562208DDCR: 可输出电流:2A;开关工作频率:580kHz;输出类型:Adjustable;输出电压的路数:1;功能类型:Step-Down;输出配置:Positive;; Supplier Part: C91301; Manufacturer: TI(德州仪器); Supplier Footprint: SOT-23-6; JLCPCB Part Class: Extended Part; Datasheet: https://atta.szlcsc.com/upload/public/pdf/source/20171106/C91301_15099535988431092949.pdf; Supplier: LCSC

## Nets
GND: C2.1 C3.1 C4.1 C5.1 C6.1 C7.1 C8.1 C10.1 C11.1 C12.1 C15.1 C16.1 C17.1 C18.1 C41.1 C72.1 C73.1 C74.1 C75.1 C76.1 C78.1 C79.1 C80.1 C81.1 C82.1 C84.2 C86.2 C87.2 C88.1 C89.1 C90.2 FB6.1 FB7.1 FPC1.1 FPC1.2 FPC1.27 FPC1.28 FPC1.29 FPC1.30 FPC1.31 FPC2.1 FPC2.5 FPC2.11 FPC2.12 LED2.2(K) R11.2 R12.2 R13.2 R19.1 R32.2 R33.2 R63.1 R65.1 R74.1 R75.1 SW4.2 SW5.2 SW6.2 U1.A10(VSS) U1.C9(VSS) U1.D4(VSS) U1.D5(VSS) U1.D6(VSS) U1.D7(VSS) U1.E4(VSS) U1.E5(VSS) U1.E6(VSS) U1.E7(VSS) U1.F4(VSS) U1.F5(VSS) U1.F6(VSS) U1.F7(VSS) U1.G4(VSS) U1.G7(VSS) U1.H1(VSS) U1.K10(VSS) U15.1(GND) U16.1(GND) U18.1(GND) U18.15(GND) U18.38(GND) U18.39(GND) U19.1(GND) USB1.1(GND) USB1.12(GND) USB1.13(SHELL) USB1.14(SHELL) X1.2(GND)
GND_P: C54.1 C55.1 C60.1 C61.1 FB7.2 FPC1.34 FPC1.37 FPC1.40 FPC1.43 FPC1.46 FPC1.49 FPC1.52 FPC1.55 FPC1.58 U12.2(GND)
GND_TMDS: C1.1 ESD1.3(GND) ESD1.8(GND) ESD2.3(GND) ESD2.8(GND) ESD3.2 FB6.2 HDMI1.2(TMDSData2Shield) HDMI1.5(TMDSData1Shield) HDMI1.8(TMDSData0Shield) HDMI1.11(TMDSClockShield) HDMI1.17(DDC/CECGround) HDMI1.20(EH)
V1.1: C3.2 C81.2 C82.2 FB2.1 FPC1.3 FPC1.4 FPC1.5 L7.2 R67.2
V1.1_TC: C7.2 FB2.2 U1.B2(VDD11_HDMI) U1.B10(VDD12_MIPI1) U1.C10(VDDC11) U1.G2(VDD11_HDMI) U1.J10(VDD12_MIPI0) U1.K6(VDDC11)
V1.8: C55.2 C60.2 FB3.1 U12.5(OUT)
V1.8_P: C61.2 FB3.2 FPC1.6 FPC1.7 FPC1.8
V3.3: C2.2 C15.2 C16.2 C17.2 C18.2 C41.2 C54.2 C75.2 C76.2 C88.2 FB1.1 FPC1.9 FPC1.10 FPC1.11 FPC2.10 L6.2 R24.2 R29.2 R30.2 R34.1 R64.2 R78.2 R79.2 U12.1(IN) U18.2(3V3) U19.4(V3) U19.16(VCC) X1.4(VCC)
V3.3_TC: C4.2 C5.2 C6.2 FB1.2 Q1.3 R9.2 R10.2 U1.B1(VDD33_HDMI) U1.G1(VDD33_HDMI) U1.H2(VDDIO33) U1.J7(VDDIO18)
V5: C72.2 C73.2 C74.2 C78.2 C79.2 C80.2 C84.1 C86.1 FPC1.23 FPC1.24 FPC1.25 FPC1.26 U15.3(VIN) U15.5(EN) U16.3(VIN) USB1.2(VBUS) USB1.11(VBUS)
V5_HDMI: C1.2 ESD3.5 HDMI1.18(+5VPower) R3.2 R4.2 R5.1 R6.1
BIASDA: C10.2 U1.J1(BIASDA)
BS_1.1: C77.1 U16.6(VBST)
BS_3.3: C71.1 U15.6(VBST)
BTN1: C89.2 R79.1 SW5.1 U18.6(IO34)
BTN2: C90.1 R78.1 SW6.1 U18.7(IO35)
CEC: ESD3.1 HDMI1.13(CEC) U1.A2(CEC)
CLK_TC: R14.1 U1.K9(REFCLK)
DAOUT: R17.1 U1.J2(DAOUT)
DDC_SCL: ESD3.6 HDMI1.15(SCL) R3.1 R7.1
DDC_SDA: ESD3.4 HDMI1.16(SDA) R4.1 R8.1
DTR: Q2.2 R77.1 U19.13(DTR#)
EN_V1.1: R32.1 U16.5(EN) U18.10(IO25)
EN_V1.8: R33.1 U12.3(EN) U18.11(IO26)
FB_1.1: R65.2 R67.1 U16.4(VFB)
FB_3.3: R63.2 R64.1 U15.4(VFB)
HDMI_CN: ESD2.5(I/O) ESD2.6(N/C) HDMI1.12(TMDSClock-) U1.C2(HDMICN)
HDMI_CP: ESD2.4(I/O) ESD2.7(N/C) HDMI1.10(TMDSClock+) U1.C1(HDMICP)
HDMI_D0N: ESD2.2(I/O) ESD2.9(N/C) HDMI1.9(TMDSData0-) U1.D2(HDMID0N)
HDMI_D0P: ESD2.1(I/O) ESD2.10(N/C) HDMI1.7(TMDSData0+) U1.D1(HDMID0P)
HDMI_D1N: ESD1.5(I/O) ESD1.6(N/C) HDMI1.6(TMDSData1-) U1.E2(HDMID1N)
HDMI_D1P: ESD1.4(I/O) ESD1.7(N/C) HDMI1.4(TMDSData1+) U1.E1(HDMID1P)
HDMI_D2N: ESD1.2(I/O) ESD1.9(N/C) HDMI1.3(TMDSData2-) U1.F2(HDMID2N)
HDMI_D2P: ESD1.1(I/O) ESD1.10(N/C) HDMI1.1(TMDSData2+) U1.F1(HDMID2P)
HPDI: R5.2 U1.A4(HPDI)
HPDO: ESD3.3 HDMI1.19(HotPlugDetect) R6.2 U1.B4(HPDO)
I2S_OSCK: FPC2.6 U1.J4(A_OSCK)
I2S_SCK: FPC2.7 U1.K7(A_SCK)
I2S_SD0: FPC2.8 U1.J9(A_SD0)
I2S_WFS: FPC2.9 U1.K5(A_WFS)
IIC_SCL: FPC2.4 R15.2 R29.1 U18.26(IO4)
IIC_SDA: FPC2.2 R16.2 R30.1 U18.23(IO15)
INT_TC: R11.1 U1.J3(INT) U18.9(IO33)
IO0: Q2.3 U18.25(IO0)
IO1: FPC1.12 U18.27(IO16)
IO2: FPC1.13 U18.28(IO17)
IO3: FPC1.14 U18.30(IO18)
IO4: FPC1.15 U18.31(IO19)
IO5: FPC1.16 U18.33(IO21)
IO6: FPC1.17 U18.36(IO22)
IO7: FPC1.18 U18.37(IO23)
IO8: FPC1.19 U18.16(IO13)
IO9: FPC1.20 U18.14(IO12)
IO10: FPC1.21 U18.13(IO14)
IO11: FPC1.22 U18.12(IO27)
IR: R12.1 U1.G6(IR)
LX_1.1: C77.2 L7.1 U16.2(SW)
LX_3.3: C71.2 L6.1 U15.2(SW)
MIPI0_CN: FPC1.38 U1.F9(CDSI0CN)
MIPI0_CP: FPC1.39 U1.F10(CDSI0CP)
MIPI0_D0N: FPC1.32 U1.H9(CDSI0D0N)
MIPI0_D0P: FPC1.33 U1.H10(CDSI0D0P)
MIPI0_D1N: FPC1.35 U1.G9(CDSI0D1N)
MIPI0_D1P: FPC1.36 U1.G10(CDSI0D1P)
MIPI0_D2N: FPC1.41 U1.E9(CDSI0D2N)
MIPI0_D2P: FPC1.42 U1.E10(CDSI0D2P)
MIPI0_D3N: FPC1.44 U1.D9(CDSI0D3N)
MIPI0_D3P: FPC1.45 U1.D10(CDSI0D3P)
MIPI1_CN: FPC1.53 U1.B7(CDSI1CN)
MIPI1_CP: FPC1.54 U1.A7(CDSI1CP)
MIPI1_D0N: FPC1.47 U1.B9(CDSI1D0N)
MIPI1_D0P: FPC1.48 U1.A9(CDSI1D0P)
MIPI1_D1N: FPC1.50 U1.B8(CDSI1D1N)
MIPI1_D1P: FPC1.51 U1.A8(CDSI1D1P)
MIPI1_D2N: FPC1.56 U1.B6(CDSI1D2N)
MIPI1_D2P: FPC1.57 U1.A6(CDSI1D2P)
MIPI1_D3N: FPC1.59 U1.B5(CDSI1D3N)
MIPI1_D3P: FPC1.60 U1.A5(CDSI1D3P)
PCKIN: C9.1 U1.K1(PCKIN)
PFIL: C8.2 R18.2 U1.K2(PFIL)
RESET_STM: C87.1 Q3.3 R24.1 SW4.1 U18.3(EN)
RESET_TC: R9.1 U1.K8(RESETN) U18.8(IO32)
REXT: R10.1 U1.A1(REXT)
RTS: Q3.2 R76.1 U19.14(RTS#)
RXD: U18.35(TXD0) U19.3(RXD)
TEST: R13.1 U1.G5(TEST)
TXD: U18.34(RXD0) U19.2(TXD)
USB_N: U19.6(D-) USB1.5(DN2) USB1.7(DN1)
USB_P: U19.5(D+) USB1.6(DP1) USB1.8(DP2)
USR_LED: FPC2.3 U18.29(IO5)
$1N1752: R7.2 U1.A3(DDC_SCL)
$1N1792: R8.2 U1.B3(DDC_SDA)
$1N2020: R16.1 U1.K3(I2C_SDA)
$1N2024: R15.1 U1.K4(I2C_SCL)
$1N3665: C12.2 Q1.1 R17.2
$1N3878: C9.2 Q1.2 R19.2
$1N4917: C11.2 R18.1
$1N5220: R14.2 X1.3(OUT)
$1N115816: R75.2 USB1.4(CC1)
$1N115820: R74.2 USB1.10(CC2)
$2N42080: Q2.1 R76.2
$2N42119: Q3.1 R77.2
$3N55984: LED2.1(A) R34.2

Not connected (* = marked no-connect by the designer): FPC1 61* 62*; HDMI1 14(Reserved(N.C.)); U1 J5(A_SD3)* J6(A_SD2)* J8(A_SD1)*; U12 4(N/C)*; U18 4(SENSOR_VP)* 5(SENSOR_VN)* 17(SHD/SD2)* 18(SWP/SD3)* 19(SCS/CMD)* 20(SCK/CLK)* 21(SDO/SD0)* 22(SDI/SD1)* 24(IO2)* 32(NC)*; U19 7(NC.)* 8(OUT#)* 9(CTS#)* 10(DSR#)* 11(RI#)* 12(DCD#)* 15(R232)*; USB1 3(SBU2)* 9(SBU1)*; X1 1(ST#)*

## Notes on the sheets
sheet 1
- BCLK
- LRCK
- MCLK
sheet 3
- 5v转3.3v
- 5v转1.1v
- 5v转1.8v - 屏幕IC电压
- HDMI信号屏蔽
- 屏幕
- 电源地
